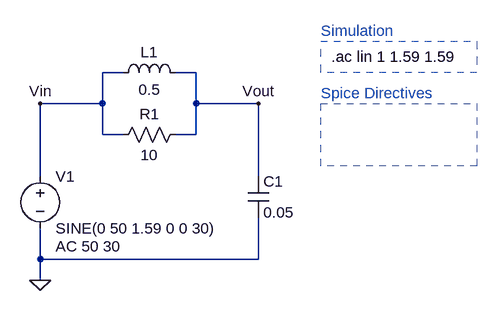
[diagram p0: schematic Example_1.asc]
Example_1.asc, the LTspice schematic file:
Version 4
SHEET 1 1532 760
WIRE 336 112 304 112
WIRE 448 112 416 112
WIRE 304 160 304 112
WIRE 304 160 208 160
WIRE 448 160 448 112
WIRE 544 160 448 160
WIRE 304 208 304 160
WIRE 336 208 304 208
WIRE 448 208 448 160
WIRE 448 208 416 208
WIRE 208 272 208 160
WIRE 544 272 544 160
WIRE 208 400 208 352
WIRE 544 400 544 336
WIRE 544 400 208 400
WIRE 208 432 208 400
FLAG 208 432 0
FLAG 544 160 Vout
FLAG 208 160 Vin
SYMBOL voltage 208 256 R0
WINDOW 123 24 124 Left 2
WINDOW 39 0 0 Left 0
SYMATTR Value2 AC 50 30
SYMATTR InstName V1
SYMATTR Value SINE(0 50 1.59 0 0 30)
SYMBOL res 432 192 R90
WINDOW 0 0 56 VBottom 2
WINDOW 3 32 56 VTop 2
SYMATTR InstName R1
SYMATTR Value 10
SYMBOL ind 320 128 R270
WINDOW 0 32 56 VTop 2
WINDOW 3 5 56 VBottom 2
SYMATTR InstName L1
SYMATTR Value 0.5
SYMBOL cap 528 272 R0
SYMATTR InstName C1
SYMATTR Value 0.05
TEXT 640 48 Left 2 ;Simulation
TEXT 640 144 Left 2 ;Spice Directives
TEXT 656 88 Left 2 !.ac lin 1 1.59 1.59
RECTANGLE Normal 880 112 640 64 2
RECTANGLE Normal 880 256 640 160 2

The netlist it stands for:
* Example_1.asc
V1 Vin 0 SINE(0 50 1.59 0 0 30) AC 50 30
R1 Vout Vin 10
L1 Vin Vout 0.5
C1 Vout 0 0.05
* Simulation
* Spice Directives
.ac lin 1 1.59 1.59
.backanno
.end